# Altium schematic sheet MCU.SchDoc
size A3
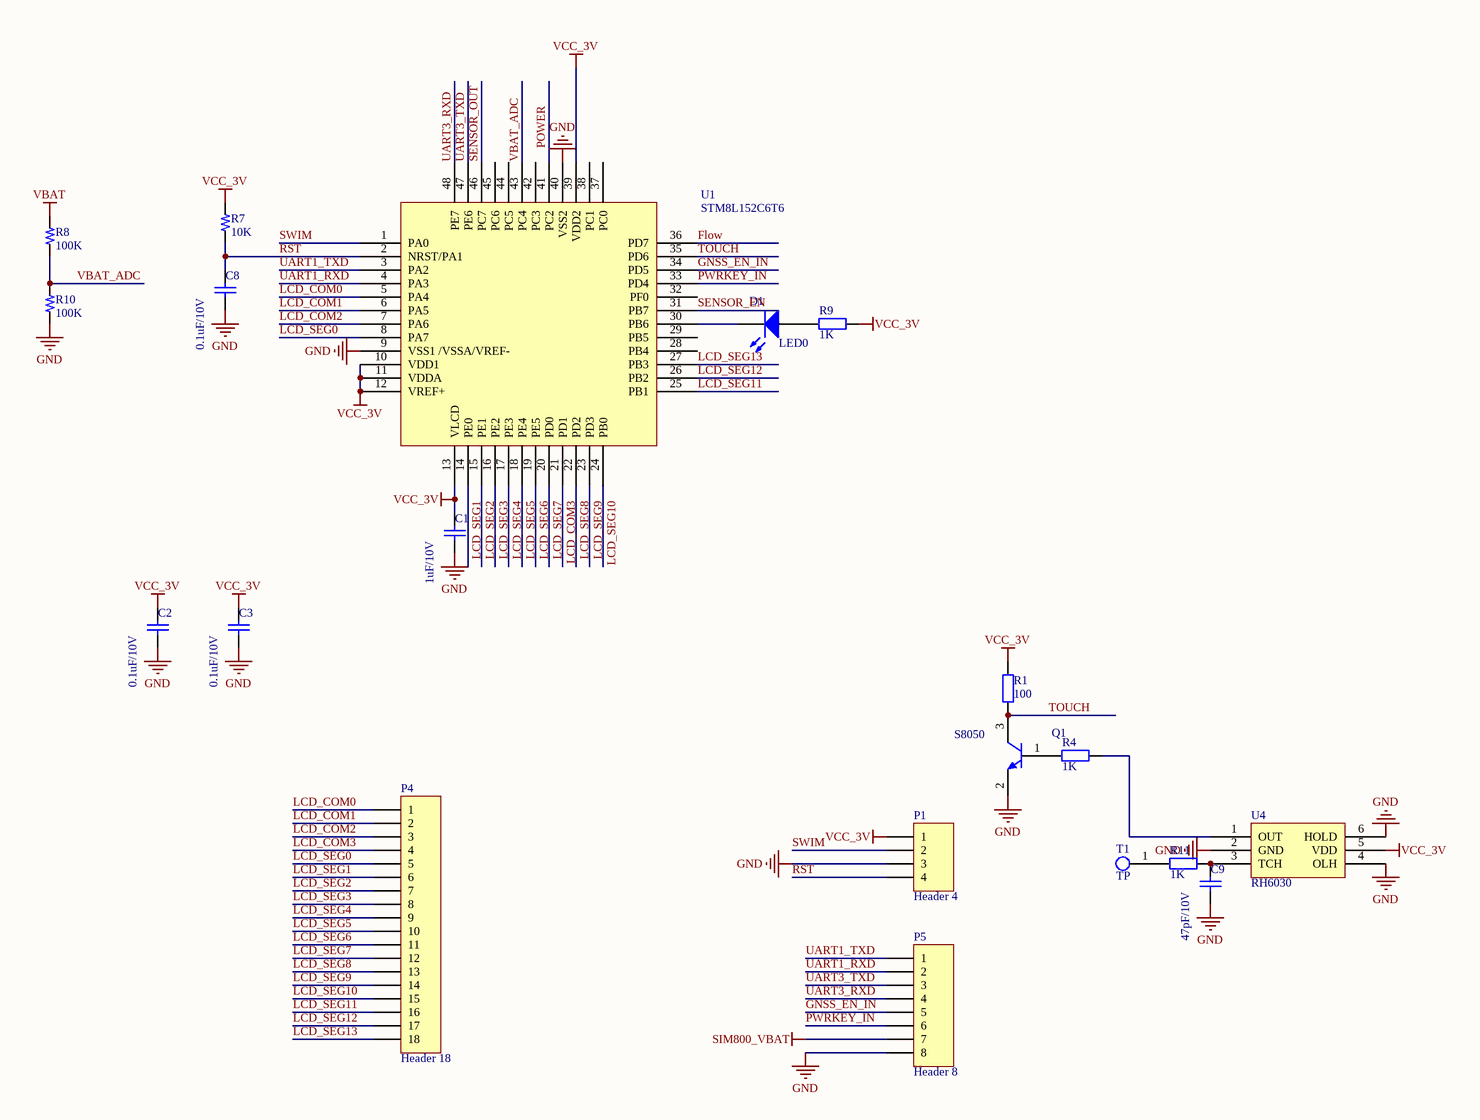
[diagram p0: MCU.SchDoc]

## Parts
C1  1uF/10V  [0603C]
C2  0.1uF/10V  [0603C]
C3  0.1uF/10V  [0603C]
C8  0.1uF/10V  [0603C]
C9  47pF/10V  [0603C]
D1  LED0  [0603LED]
P1  Header 4  [HDR1X4]
P4  Header 18  [lcd]
P5  Header 8  [HDR1X8]
Q1  S8050  [SOT23-3]
R1  100  [0603R]
R4  1K  [0603R]
R7  10K  [0603R]
R8  100K  [0603R]
R9  1K  [0603R]
R10  100K  [0603R]
R11  1K  [0603R]
T1  TP  [TOUCH-PAD]
U1  STM8L152C6T6  [TQFP-48]
U4  RH6030  [SOT-23-6]

## Nets
GND: C1.2 C2.2 C3.2 C8.2 C9.2 P1.3 P5.8 Q1.2(E) R10.1 U1.9(VSS1_/VSSA/VREF-) U1.40(VSS2) U4.2(GND) U4.4(OLH) U4.6(HOLD)
SIM800_VBAT: P5.7
VBAT: R8.2
VCC_3V: C1.1 C2.1 C3.1 P1.1 R1.1 R7.2 R9.1 U1.10(VDD1) U1.11(VDDA) U1.12(VREF+) U1.13(VLCD) U1.39(VDD2) U4.5(VDD)
Flow: U1.36(PD7)
GNSS_EN_IN: P5.5 U1.34(PD5)
LCD_COM0: P4.1 U1.5(PA4)
LCD_COM1: P4.2 U1.6(PA5)
LCD_COM2: P4.3 U1.7(PA6)
LCD_COM3: P4.4 U1.21(PD1)
LCD_SEG0: P4.5 U1.8(PA7)
LCD_SEG1: P4.6 U1.14(PE0)
LCD_SEG2: P4.7 U1.15(PE1)
LCD_SEG3: P4.8 U1.16(PE2)
LCD_SEG4: P4.9 U1.17(PE3)
LCD_SEG5: P4.10 U1.18(PE4)
LCD_SEG6: P4.11 U1.19(PE5)
LCD_SEG7: P4.12 U1.20(PD0)
LCD_SEG8: P4.13 U1.22(PD2)
LCD_SEG9: P4.14 U1.23(PD3)
LCD_SEG10: P4.15 U1.24(PB0)
LCD_SEG11: P4.16 U1.25(PB1)
LCD_SEG12: P4.17 U1.26(PB2)
LCD_SEG13: P4.18 U1.27(PB3)
POWER: U1.41(PC2)
PWRKEY_IN: P5.6 U1.33(PD4)
RST: C8.1 P1.4 R7.1 U1.2(NRST/PA1)
SENSOR_EN: U1.31(PB7)
SENSOR_OUT: U1.46(PC7)
SWIM: P1.2 U1.1(PA0)
TOUCH: Q1.3(C) R1.2 U1.35(PD6)
UART1_RXD: P5.2 U1.4(PA3)
UART1_TXD: P5.1 U1.3(PA2)
UART3_RXD: P5.4 U1.48(PE7)
UART3_TXD: P5.3 U1.47(PE6)
VBAT_ADC: R8.1 R10.2 U1.43(PC4)
NetC9_1: C9.1 R11.1 U4.3(TCH)
NetD1_1: D1.1(A) R9.2
NetD1_2: D1.2(K) U1.30(PB6)
NetQ1_1: Q1.1(B) R4.2
NetR4_1: R4.1 U4.1(OUT)
NetR11_2: R11.2 T1.1

Not connected (* = marked no-connect by the designer): U1 28(PB4) 29(PB5) 32(PF0) 37(PC0) 38(PC1) 42(PC3) 44(PC5) 45(PC6)

## Library data of the parts
C1-C3 C8 C9 = Cap: Capacitor; Value: 104; Published: 8-Jun-2000; LatestRevisionDate: 17-Jul-2002; LatestRevisionNote: Re-released for DXP Platform.; PackageReference: RAD-0.3; Publisher: Altium Limited
D1 = LED0: Typical INFRARED GaAs LED; Published: 8-Jun-2000; LatestRevisionDate: 08-Jul-2005; LatestRevisionNote: Mech Layer 1 removed.; PackageReference: LED-0; Publisher: Altium Limited
P1 = Header 4: Header, 4-Pin; LatestRevisionDate: 17-Jul-2002; LatestRevisionNote: Re-released for DXP Platform.; Publisher: Altium Limited
P4 = Header 18: Header, 18-Pin; LatestRevisionDate: 17-Jul-2002; LatestRevisionNote: Re-released for DXP Platform.; Publisher: Altium Limited
P5 = Header 8: Header, 8-Pin; LatestRevisionDate: 17-Jul-2002; LatestRevisionNote: Re-released for DXP Platform.; Publisher: Altium Limited
Q1 = NPN
R1 = Res2: Resistor; Value: 1K; Published: 8-Jun-2000; LatestRevisionDate: 17-Jul-2002; LatestRevisionNote: Re-released for DXP Platform.; PackageReference: AXIAL-0.4; Publisher: Altium Limited
R4 R9 R11 = Res2: Resistor; Published: 8-Jun-2000; LatestRevisionDate: 17-Jul-2002; LatestRevisionNote: Re-released for DXP Platform.; PackageReference: AXIAL-0.4; Publisher: Altium Limited; Value: 1K
R7 R8 R10 = R